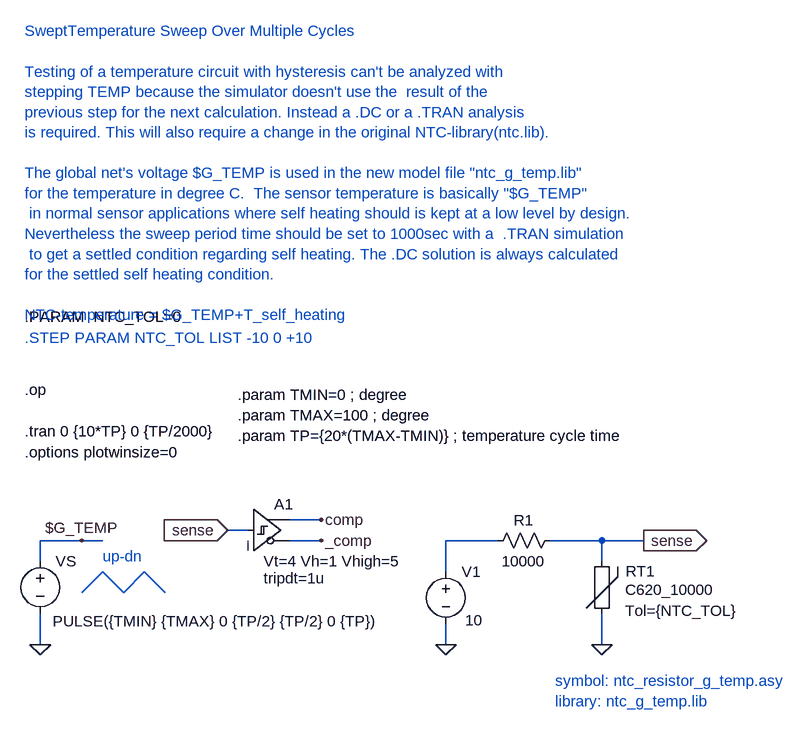
[diagram p0: schematic Epcos_Test_Comparator_tr.asc]
Epcos_Test_Comparator_tr.asc, the LTspice schematic file:
Version 4
SHEET 1 1356 680
WIRE 304 208 256 208
WIRE 192 224 160 224
WIRE -64 240 -128 240
WIRE -32 240 -64 240
WIRE 304 240 256 240
WIRE 576 240 496 240
WIRE 736 240 656 240
WIRE 800 240 736 240
WIRE -128 272 -128 240
WIRE 736 272 736 240
WIRE 496 288 496 240
WIRE -128 400 -128 352
WIRE 496 400 496 368
WIRE 736 400 736 352
FLAG 736 400 0
FLAG 496 400 0
FLAG 800 240 sense
IOPIN 800 240 Out
FLAG 304 208 comp
FLAG 160 224 sense
IOPIN 160 224 In
FLAG -128 400 0
FLAG -64 240 $G_TEMP
FLAG 304 240 _comp
SYMBOL res 560 256 R270
WINDOW 0 32 56 VTop 0
WINDOW 3 0 56 VBottom 0
SYMATTR InstName R1
SYMATTR Value 10000
SYMBOL voltage 496 272 R0
WINDOW 3 30 91 Left 0
WINDOW 123 0 0 Left 0
WINDOW 39 0 0 Left 0
SYMATTR Value 10
SYMATTR InstName V1
SYMBOL Digital\\schmitt 192 160 R0
WINDOW 3 24 112 Left 0
WINDOW 123 24 138 Left 0
SYMATTR Value Vt=4 Vh=1 Vhigh=5
SYMATTR InstName A1
SYMATTR Value2 tripdt=1u
SYMBOL ntc_resistor_g_temp 720 256 R0
SYMATTR InstName RT1
SYMATTR SpiceModel C620_10000
SYMATTR Value Tol={NTC_TOL}
SYMBOL voltage -128 256 R0
WINDOW 3 19 108 Left 0
WINDOW 123 0 0 Left 0
WINDOW 39 0 0 Left 0
SYMATTR InstName VS
SYMATTR Value PULSE({TMIN} {TMAX} 0 {TP/2} {TP/2} 0 {TP})
TEXT -152 8 Left 0 !.op
TEXT -152 -72 Left 0 ;.STEP PARAM NTC_TOL LIST -10 0 +10
TEXT -152 -104 Left 0 !.PARAM  NTC_TOL=0
TEXT -152 -544 Left 0 ;SweptTemperature Sweep Over Multiple Cycles\n \nTesting of a temperature circuit with hysteresis can't be analyzed with\nstepping TEMP because the simulator doesn't use the  result of the \nprevious step for the next calculation. Instead a .DC or a .TRAN analysis \nis required. This will also require a change in the original NTC-library(ntc.lib).\n \nThe global net's voltage $G_TEMP is used in the new model file "ntc_g_temp.lib"\nfor the temperature in degree C.  The sensor temperature is basically "$G_TEMP"\n in normal sensor applications where self heating should is kept at a low level by design.\nNevertheless the sweep period time should be set to 1000sec with a  .TRAN simulation\n to get a settled condition regarding self heating. The .DC solution is always calculated\nfor the settled self heating condition.\n \nNTC-temperature = $G_TEMP+T_self_heating
TEXT -152 72 Left 0 !.tran 0 {10*TP} 0 {TP/2000}
TEXT -152 104 Left 0 !.options plotwinsize=0
TEXT 176 16 Left 0 !.param TMIN=0 ; degree\n.param TMAX=100 ; degree\n.param TP={20*(TMAX-TMIN)} ; temperature cycle time
TEXT 664 456 Left 0 ;symbol: ntc_resistor_g_temp.asy\nlibrary: ntc_g_temp.lib
TEXT -32 264 Left 0 ;up-dn
LINE Normal -32 288 -64 320
LINE Normal 0 320 -32 288
LINE Normal 32 288 0 320
LINE Normal 64 320 32 288

The netlist it stands for:
* Epcos_Test_Comparator_tr.asc
R1 N001 sense 10000
V1 N001 0 10
A1 sense 0 0 0 0 _comp comp 0 SCHMITT Vt=4 Vh=1 Vhigh=5 tripdt=1u
XRT1 sense 0 C620_10000 Tol={NTC_TOL}  ; pins A B
VS $G_TEMP 0 PULSE({TMIN} {TMAX} 0 {TP/2} {TP/2} 0 {TP})
.op
* .STEP PARAM NTC_TOL LIST -10 0 +10
.PARAM  NTC_TOL=0
* SweptTemperature Sweep Over Multiple Cycles
* Testing of a temperature circuit with hysteresis can't be analyzed with
* stepping TEMP because the simulator doesn't use the  result of the
* previous step for the next calculation. Instead a .DC or a .TRAN analysis
* is required. This will also require a change in the original NTC-library(ntc.lib).
* The global net's voltage $G_TEMP is used in the new model file "ntc_g_temp.lib"
* for the temperature in degree C.  The sensor temperature is basically "$G_TEMP"
*  in normal sensor applications where self heating should is kept at a low level by design.
* Nevertheless the sweep period time should be set to 1000sec with a  .TRAN simulation
*  to get a settled condition regarding self heating. The .DC solution is always calculated
* for the settled self heating condition.
* NTC-temperature = $G_TEMP+T_self_heating
.tran 0 {10*TP} 0 {TP/2000}
.options plotwinsize=0
.param TMIN=0 ; degree
.param TMAX=100 ; degree
.param TP={20*(TMAX-TMIN)} ; temperature cycle time
* symbol: ntc_resistor_g_temp.asy
* library: ntc_g_temp.lib
* up-dn
.lib NTC_g_temp.lib
.backanno
.end